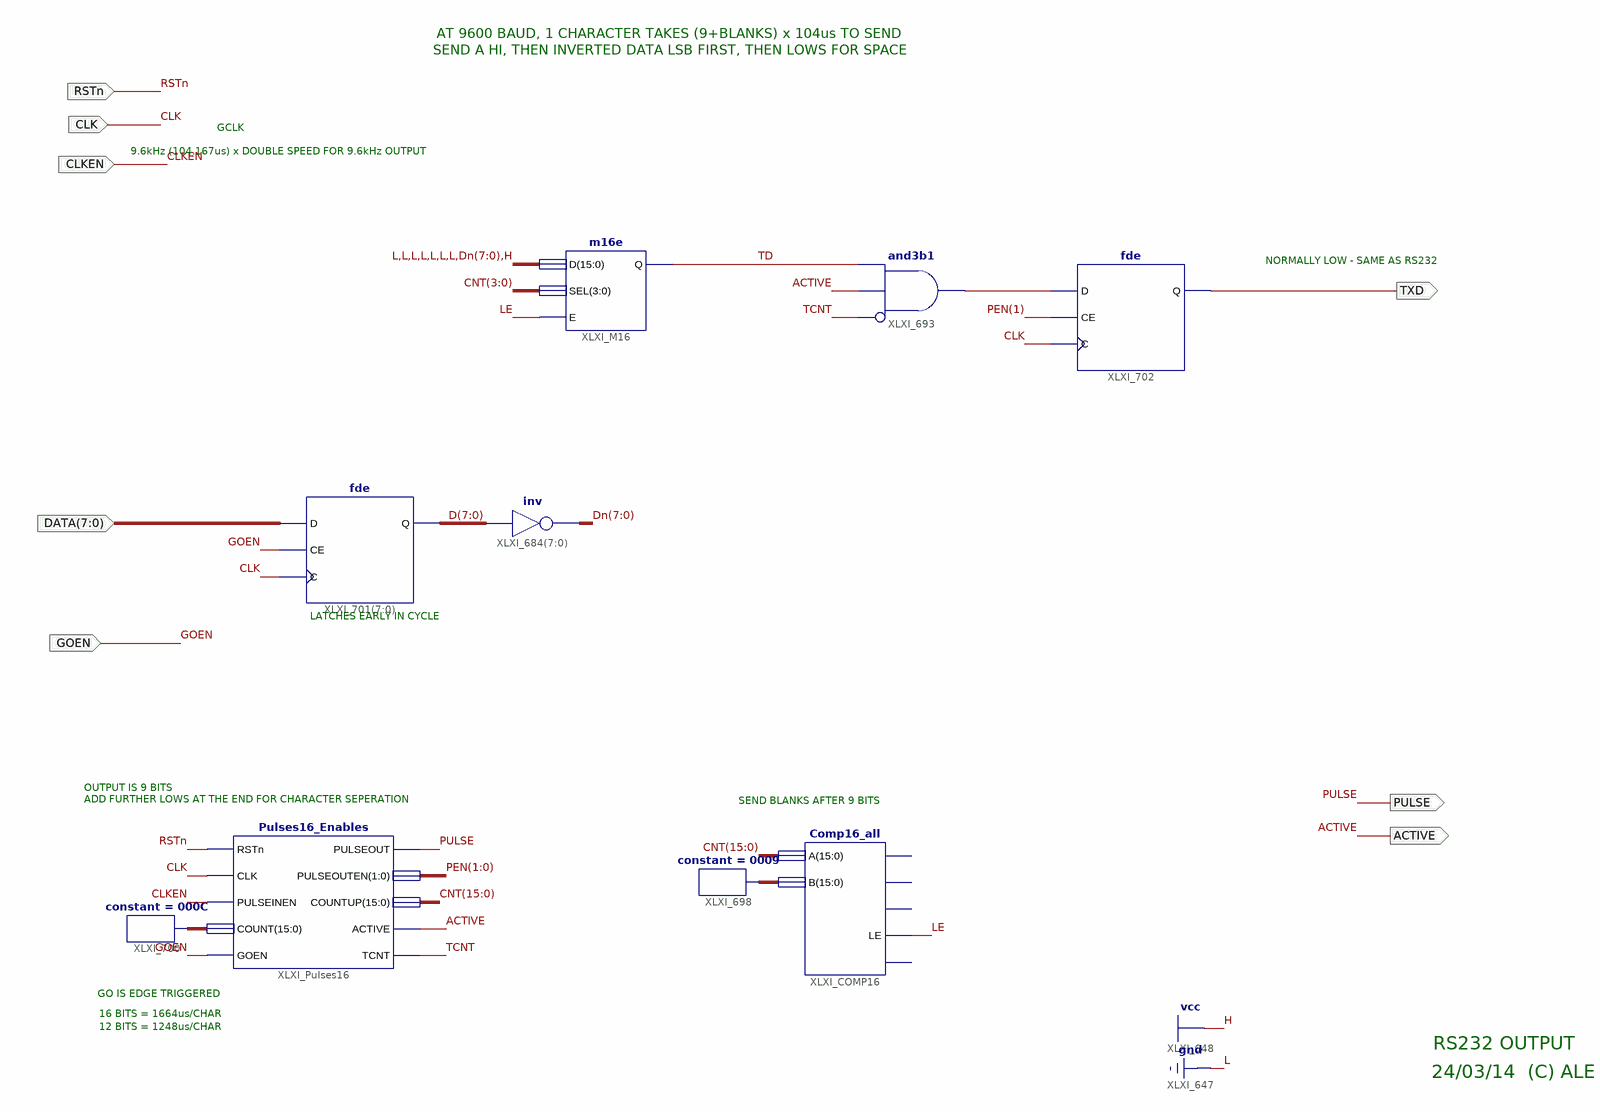
[diagram p0: schematic sheet 1]
// Xilinx ISE schematic RS232.sch (zynq) as structural Verilog: 9 symbols, 8 ports
module RS232 (
  input  RSTn,
  input  CLK,
  input  GOEN,
  input  [7:0] DATA,
  input  CLKEN,
  output PULSE,
  output ACTIVE,
  output TXD
);

  wire LE, TCNT, TD, XLXN_91;
  wire [1:0] PEN;
  wire [7:0] D, Dn;
  wire [15:0] CNT, XLXN_116, XLXN_121;

  assign Dn = ~D;  // inv XLXI_684[7..0], 8 bits wide
  m16e XLXI_M16 (.D({{7{1'b0}}, Dn, 1'b1}), .E(LE), .Q(TD), .SEL(CNT[3:0]));
  and XLXI_693 (XLXN_91, ~TCNT, ACTIVE, TD);  // and3b1
  fde XLXI_701[7:0] (.C(CLK), .CE(GOEN), .D(DATA), .Q(D));
  fde XLXI_702 (.C(CLK), .CE(PEN[1]), .D(XLXN_91), .Q(TXD));
  Pulses16_Enables XLXI_Pulses16 (
    .ACTIVE(ACTIVE), .CLK(CLK), .COUNT(XLXN_121), .COUNTUP(CNT), .GOEN(GOEN), .PULSEINEN(CLKEN),
    .PULSEOUT(PULSE), .PULSEOUTEN(PEN), .RSTn(RSTn), .TCNT(TCNT));
  constant #(.CValue("000C")) XLXI_700 (.O(XLXN_121));
  Comp16_all XLXI_COMP16 (.A(CNT), .B(XLXN_116), .LE(LE));  // open: EQ, GE, GT, LT
  constant #(.CValue("0009")) XLXI_698 (.O(XLXN_116));

  // Notes on the sheet:
  //   AT 9600 BAUD, 1 CHARACTER TAKES (9+BLANKS) x 104us TO SEND
  //   SEND A HI, THEN INVERTED DATA LSB FIRST, THEN LOWS FOR SPACE
  //   GCLK
  //   9.6kHz (104.167us) x DOUBLE SPEED FOR 9.6kHz OUTPUT
  //   NORMALLY LOW - SAME AS RS232
  //   LATCHES EARLY IN CYCLE
  //   OUTPUT IS 9 BITS
  //   ADD FURTHER LOWS AT THE END FOR CHARACTER SEPERATION
  //   SEND BLANKS AFTER 9 BITS
  //   GO IS EDGE TRIGGERED
  //   16 BITS = 1664us/CHAR
  //   12 BITS = 1248us/CHAR
  //   RS232 OUTPUT
  //   24/03/14  (C) ALE
endmodule
